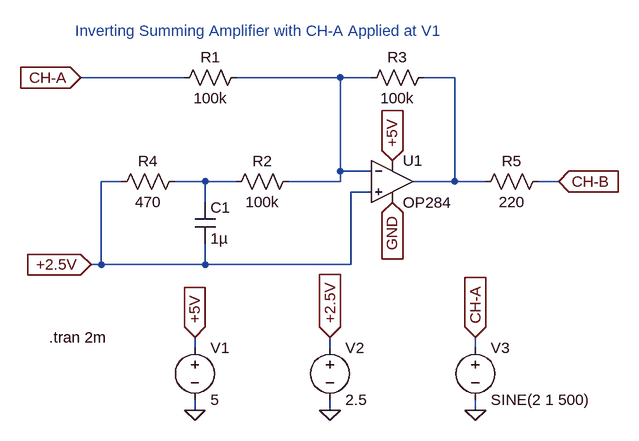
[diagram p0: schematic inv_sum_amp_with_ch-a_v1_ltspice.asc]
inv_sum_amp_with_ch-a_v1_ltspice.asc, the LTspice schematic file:
Version 4
SHEET 1 880 776
WIRE -144 80 -304 80
WIRE 96 80 -64 80
WIRE 144 80 96 80
WIRE 272 80 224 80
WIRE 96 224 96 80
WIRE 144 224 96 224
WIRE -240 240 -272 240
WIRE -112 240 -160 240
WIRE -64 240 -112 240
WIRE 96 240 96 224
WIRE 96 240 16 240
WIRE 272 240 272 80
WIRE 272 240 208 240
WIRE 320 240 272 240
WIRE 432 240 400 240
WIRE 144 256 112 256
WIRE -112 272 -112 240
WIRE -272 368 -272 240
WIRE -272 368 -288 368
WIRE -112 368 -112 336
WIRE -112 368 -272 368
WIRE 112 368 112 256
WIRE 112 368 -112 368
WIRE -128 496 -128 480
WIRE 80 496 80 480
WIRE 304 496 304 480
WIRE -128 592 -128 576
WIRE 80 592 80 576
WIRE 304 592 304 576
FLAG 176 208 +5V
IOPIN 176 208 In
FLAG 176 272 GND
IOPIN 176 272 In
FLAG -304 80 CH-A
IOPIN -304 80 In
FLAG -288 368 +2.5V
IOPIN -288 368 In
FLAG 432 240 CH-B
IOPIN 432 240 In
FLAG -128 592 0
FLAG 80 592 0
FLAG 304 592 0
FLAG -128 480 +5V
IOPIN -128 480 In
FLAG 80 480 +2.5V
IOPIN 80 480 In
FLAG 304 480 CH-A
IOPIN 304 480 In
SYMBOL Opamps\\OP284 176 176 R0
SYMATTR InstName U1
SYMBOL res -48 64 R90
WINDOW 0 0 56 VBottom 2
WINDOW 3 32 56 VTop 2
SYMATTR InstName R1
SYMATTR Value 100k
SYMBOL res 32 224 R90
WINDOW 0 0 56 VBottom 2
WINDOW 3 32 56 VTop 2
SYMATTR InstName R2
SYMATTR Value 100k
SYMBOL res 240 64 R90
WINDOW 0 0 56 VBottom 2
WINDOW 3 32 56 VTop 2
SYMATTR InstName R3
SYMATTR Value 100k
SYMBOL res -144 224 R90
WINDOW 0 0 56 VBottom 2
WINDOW 3 32 56 VTop 2
SYMATTR InstName R4
SYMATTR Value 470
SYMBOL res 416 224 R90
WINDOW 0 0 56 VBottom 2
WINDOW 3 32 56 VTop 2
SYMATTR InstName R5
SYMATTR Value 220
SYMBOL cap -128 272 R0
SYMATTR InstName C1
SYMATTR Value 1µ
SYMBOL voltage -128 480 R0
SYMATTR InstName V1
SYMATTR Value 5
SYMBOL voltage 80 480 R0
SYMATTR InstName V2
SYMATTR Value 2.5
SYMBOL voltage 304 480 R0
WINDOW 123 0 0 Left 0
WINDOW 39 0 0 Left 0
SYMATTR InstName V3
SYMATTR Value SINE(2 1 500)
TEXT -312 8 Left 2 ;Inverting Summing Amplifier with CH-A Applied at V1
TEXT -352 480 Left 2 !.tran 2m

The netlist it stands for:
* inv_sum_amp_with_ch-a_v1_ltspice.asc
XU1 +2.5V N001 +5V GND N002 OP284  ; pins In+ In- V+ V- OUT
R1 N001 CH-A 100k
R2 N001 N003 100k
R3 N002 N001 100k
R4 N003 +2.5V 470
R5 CH-B N002 220
C1 N003 +2.5V 1µ
V1 +5V 0 5
V2 +2.5V 0 2.5
V3 CH-A 0 SINE(2 1 500)
* Inverting Summing Amplifier with CH-A Applied at V1
.tran 2m
.lib ADI1.lib
.backanno
.end